# Altium project Honolulu.PrjPcb (part 3 of 3)

## Sheet I2C extender 1.SchDoc
size A4; SheetNumber: 5; SheetTotal: 6
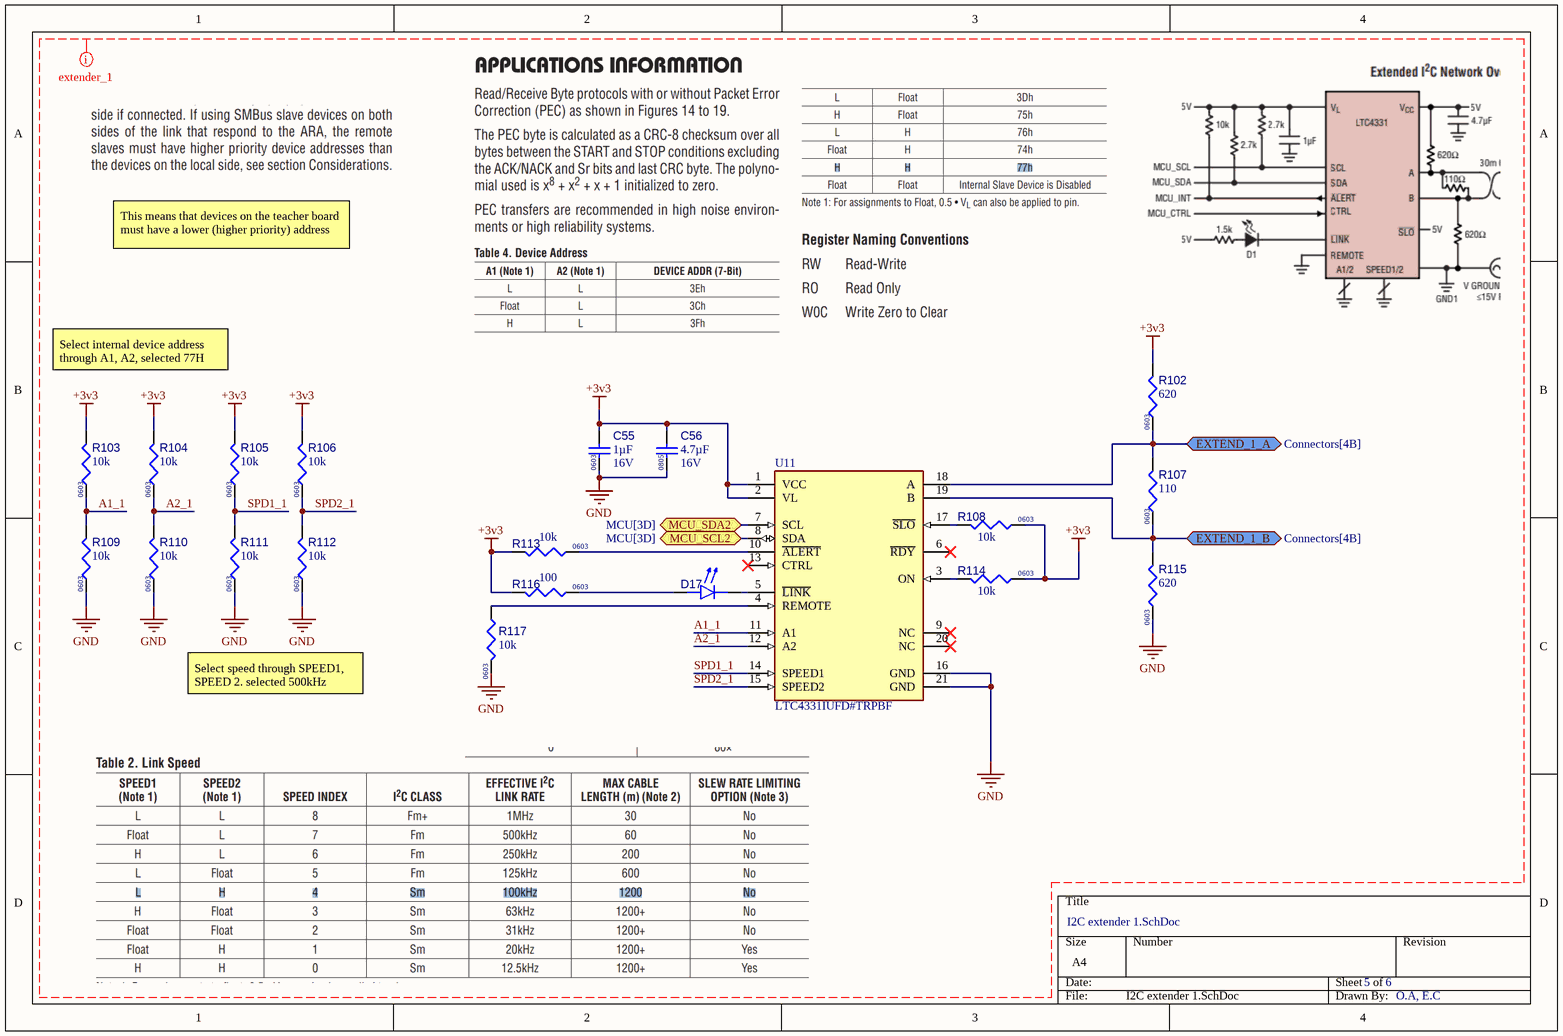
[diagram p8: I2C extender 1.SchDoc]

### Parts
C55  value 1µF  Case/Package: 0603  Voltage Rating: 16V  [CAPC1608X90X35NL15T15]  (hidden comment: Capacitor 1uF +/- 10% 16V 0603)
C56  value 4.7µF  Case/Package: 0805  Rated DC Voltage (URdc): 16V  [CL21A475KOFNNNE-Footprint-1]  (hidden comment: CL21A475KOFNNNE)
D17  150060YS75000  [WL-SMCW_0603_150060xx75000]  (value not drawn)
R102  value 620  Case/Package: 0603  [RC0603JR-0720KL-Footprint-1]  (hidden comment: RC0603FR-07620RL)
R103  value 10k  Case/Package: 0603  [RESC1608X55X25NL10T15]  (hidden comment: Resistor 10k +/-1% 0603 100 mW)
R104  value 10k  Case/Package: 0603  [RESC1608X55X25NL10T15]  (hidden comment: Resistor 10k +/-1% 0603 100 mW)
R105  value 10k  Case/Package: 0603  [RESC1608X55X25NL10T15]  (hidden comment: Resistor 10k +/-1% 0603 100 mW)
R106  value 10k  Case/Package: 0603  [RESC1608X55X25NL10T15]  (hidden comment: Resistor 10k +/-1% 0603 100 mW)
R107  value 110  Case/Package: 0603  [RC0603JR-0720KL-Footprint-1]  (hidden comment: RC0603FR-07110RL)
R108  value 10k  Case/Package: 0603  [RESC1608X55X25NL10T15]  (hidden comment: Resistor 10k +/-1% 0603 100 mW)
R109  value 10k  Case/Package: 0603  [RESC1608X55X25NL10T15]  (hidden comment: Resistor 10k +/-1% 0603 100 mW)
R110  value 10k  Case/Package: 0603  [RESC1608X55X25NL10T15]  (hidden comment: Resistor 10k +/-1% 0603 100 mW)
R111  value 10k  Case/Package: 0603  [RESC1608X55X25NL10T15]  (hidden comment: Resistor 10k +/-1% 0603 100 mW)
R112  value 10k  Case/Package: 0603  [RESC1608X55X25NL10T15]  (hidden comment: Resistor 10k +/-1% 0603 100 mW)
R113  value 10k  Case/Package: 0603  [RESC1608X55X25NL10T15]  (hidden comment: Resistor 10k +/-1% 0603 100 mW)
R114  value 10k  Case/Package: 0603  [RESC1608X55X25NL10T15]  (hidden comment: Resistor 10k +/-1% 0603 100 mW)
R115  value 620  Case/Package: 0603  [RC0603JR-0720KL-Footprint-1]  (hidden comment: RC0603FR-07620RL)
R116  value 100  Case/Package: 0603  [RC0603JR-0720KL-Footprint-1]  (hidden comment: RC0603FR-07100RL)
R117  value 10k  Case/Package: 0603  [RESC1608X55X25NL10T15]  (hidden comment: Resistor 10k +/-1% 0603 100 mW)
U11  LTC4331IUFD#TRPBF  [FP-UFD-20-05-08-1711-IPC_C]

### Ports
EXTEND_1_A (bidir, see Connectors[4B]), EXTEND_1_B (bidir, see Connectors[4B]), MCU_SCL2 (bidir, see MCU[3D]), MCU_SDA2 (bidir, see MCU[3D])

### Nets
+3V3: C55.2 C56.2 R102.2 R103.2 R104.2 R105.2 R106.2 R108.1 R113.1 R114.1 R116.2 U11.1(VCC) U11.2(VL)
GND: C55.1 C56.1 R109.1 R110.1 R111.1 R112.1 R115.1 R117.1 U11.16(GND) U11.21(GND)
A1_1: R103.1 R109.2 U11.11(A1)
A2_1: R104.1 R110.2 U11.12(A2)
SCL2: U11.8(SDA) ; port MCU_SCL2
SDA2: U11.7(SCL) ; port MCU_SDA2
SPD1_1: R105.1 R111.2 U11.14(SPEED1)
SPD2_1: R106.1 R112.2 U11.15(SPEED2)
NetD17_1: D17.1(K) U11.5(~{LINK})
NetD17_2: D17.2(A) R116.1
NetJ20_5: R102.1 R107.2 U11.18(A) ; port EXTEND_1_A
NetJ20_6: R107.1 R115.2 U11.19(B) ; port EXTEND_1_B
NetR108_2: R108.2 U11.17(~{SLO})
NetR113_2: R113.2 U11.10(~{ALERT})
NetR114_2: R114.2 U11.3(ON)
NetR117_2: R117.2 U11.4(REMOTE)

Not connected (* = marked no-connect by the designer): U11 6(~{RDY})* 9(NC)* 13(CTRL)* 20(NC)*

### Layout directives
mark named extender_1: +3v3, A1_1, A2_1, GND, SPD1_1, SPD2_1

### Notes on the sheet
- This means that devices on the teacher board must have a lower (higher priority) address
- Select internal device address through A1, A2, selected 77H
- Select speed through SPEED1, SPEED 2. selected 500kHz
- O.A, E.C

### Library data of the parts
C55 = CMP-001-00004-8: Chip Capacitor, 1 uF, +/- 10%, 16 V, 0603 (1608 Metric); Capacitor Type: Ceramic; Mounting Technology: SM; RoHS Compliant: True; Min Operating Temperature: -55°C; Pins: 2; Max Operating Temperature: 125°C; Tolerance: 10%
C56 = CMP-001-00089-2: Ceramic Capacitor, Multilayer, Ceramic, 16V, 10% +Tol, 10% -Tol, X5R, 15% TC, 4.7uF, Surface Mount, 0805; Multilayer: Yes; Dielectric Material: Ceramic; Tolerance (fill in as +-): 10%; Pins: 2; Package Style: SMTMeter; Max Operating Temperature: 85°C; JESD-609 Code: e3; Termination: Wraparound; Min Operating Temperature: -55°C; RoHS Compliant: Yes; Mounting Technology: Surface Mount; Reach SVHC Compliant: Yes; Terminal Finish: Nickel; Packaging: Tape and Reel; Capacitor Type: Ceramic; Height: 1.35mm; Width: 1.25mm; Temperature Characteristics Code: X5R; Length: 2mm; Tolerance  (fill in as +-): 10%; Package Shape: Rectangular
D17 = CMP-007-00046-1: Single Color LED, Yellow, Water Clear, 1.1mm; Shape: Rectangular; Forward Current: 30mA; Forward Voltage: 2V; Viewing Angle: 140°; Channels: 1; Luminous Intensity-Nom: 120mcd; Overall Height: 0.7mm; Packaging: Tape and Reel; Size: 1.1mm; Max Operating Temperature: 85°C; RoHS Compliant: Yes; Color: Yellow; Pins: 2; Lens Style: WATER CLEAR; Reach SVHC Compliant: Yes; Terminal Pitch: 1.6mm; Mounting Technology: Surface Mount; Min Operating Temperature: -40°C; Optoelectronic Device Type: SINGLE COLOR LED
R102 R115 = CMP-009-00191-1: Fixed Resistor, Metal Glaze/thick Film, 0.1W, 620ohm, 75V, 1% +/-Tol, 100ppm/Cel, Surface Mount, 0603; Power: 100mW; Additional Feature: LASER TRIMMABLE; Package Height: 0.45mm; Package Width: 0.8mm; Temperature Coefficient: 100ppm/°C; Rated Temperature: 70°C; Package Length: 1.6mm; Package Shape: Rectangular; Min Operating Temperature: -55°C; Technology: METAL GLAZE/THICK FILM; Reach SVHC Compliant: Yes; Pins: 2; Working Voltage: 75V; Tolerance: 1%; Terminal Finish: Nickel; RoHS Compliant: Yes; Termination: Wraparound; Construction: Chip; JESD-609 Code: e3; Mounting Technology: Surface Mount; Max Operating Temperature: 155°C; Package Style: SMTMeter; Packaging: Tape and Reel; Resistor Type: FIXED RESISTOR
R103-R106 R108-R114 R117 = CMP-009-00017-7: as R88-R94 on sheet I2C extender 0; RoHS Compliant: True; Min Operating Temperature: -55°C; Pins: 2; Mounting Technology: SM; Max Operating Temperature: 155°C; Tolerance: 1%
R107 = CMP-009-00190-1: Fixed Resistor, Metal Glaze/thick Film, 0.1W, 110ohm, 75V, 1% +/-Tol, 100ppm/Cel, Surface Mount, 0603; Package Length: 1.6mm; Temperature Coefficient: 100ppm/°C; Power: 100mW; Package Height: 0.45mm; Package Width: 0.8mm; Additional Feature: LASER TRIMMABLE; Rated Temperature: 70°C; Termination: Wraparound; JESD-609 Code: e3; RoHS Compliant: Yes; Tolerance: 1%; Max Operating Temperature: 155°C; Package Style: SMTMeter; Terminal Finish: Nickel; Packaging: Tape and Reel; Package Shape: Rectangular; Pins: 2; Working Voltage: 75V; Construction: Chip; Resistor Type: FIXED RESISTOR; Technology: METAL GLAZE/THICK FILM; Reach SVHC Compliant: Yes; Mounting Technology: Surface Mount; Min Operating Temperature: -55°C
R116 = CMP-009-00189-1: Fixed Resistor, Metal Glaze/thick Film, 0.1W, 100ohm, 75V, 1% +/-Tol, 100ppm/Cel, Surface Mount, 0603; Rated Temperature: 70°C; Package Width: 0.8mm; Package Length: 1.6mm; Package Height: 0.45mm; Additional Feature: LASER TRIMMABLE; Temperature Coefficient: 100ppm/°C; Power: 100mW; Package Shape: Rectangular; Tolerance: 1%; JESD-609 Code: e3; Resistor Type: FIXED RESISTOR; Terminal Finish: Nickel; Max Operating Temperature: 155°C; Reach SVHC Compliant: Yes; Technology: METAL GLAZE/THICK FILM; Mounting Technology: Surface Mount; RoHS Compliant: Yes; Construction: Chip; Packaging: Tape and Reel; Package Style: SMTMeter; Termination: Wraparound; Working Voltage: 75V; Min Operating Temperature: -55°C; Pins: 2
U11 = CMP-015-00011-1: Interface Circuit, CMOS, PQCC20; Throw Configuration: POWER SUPPLY SUPPORT CIRCUIT; Reach SVHC Compliant: Yes; RoHS Compliant: Yes

## Sheet Connectors.SchDoc
size A4; SheetNumber: 7; SheetTotal: 6
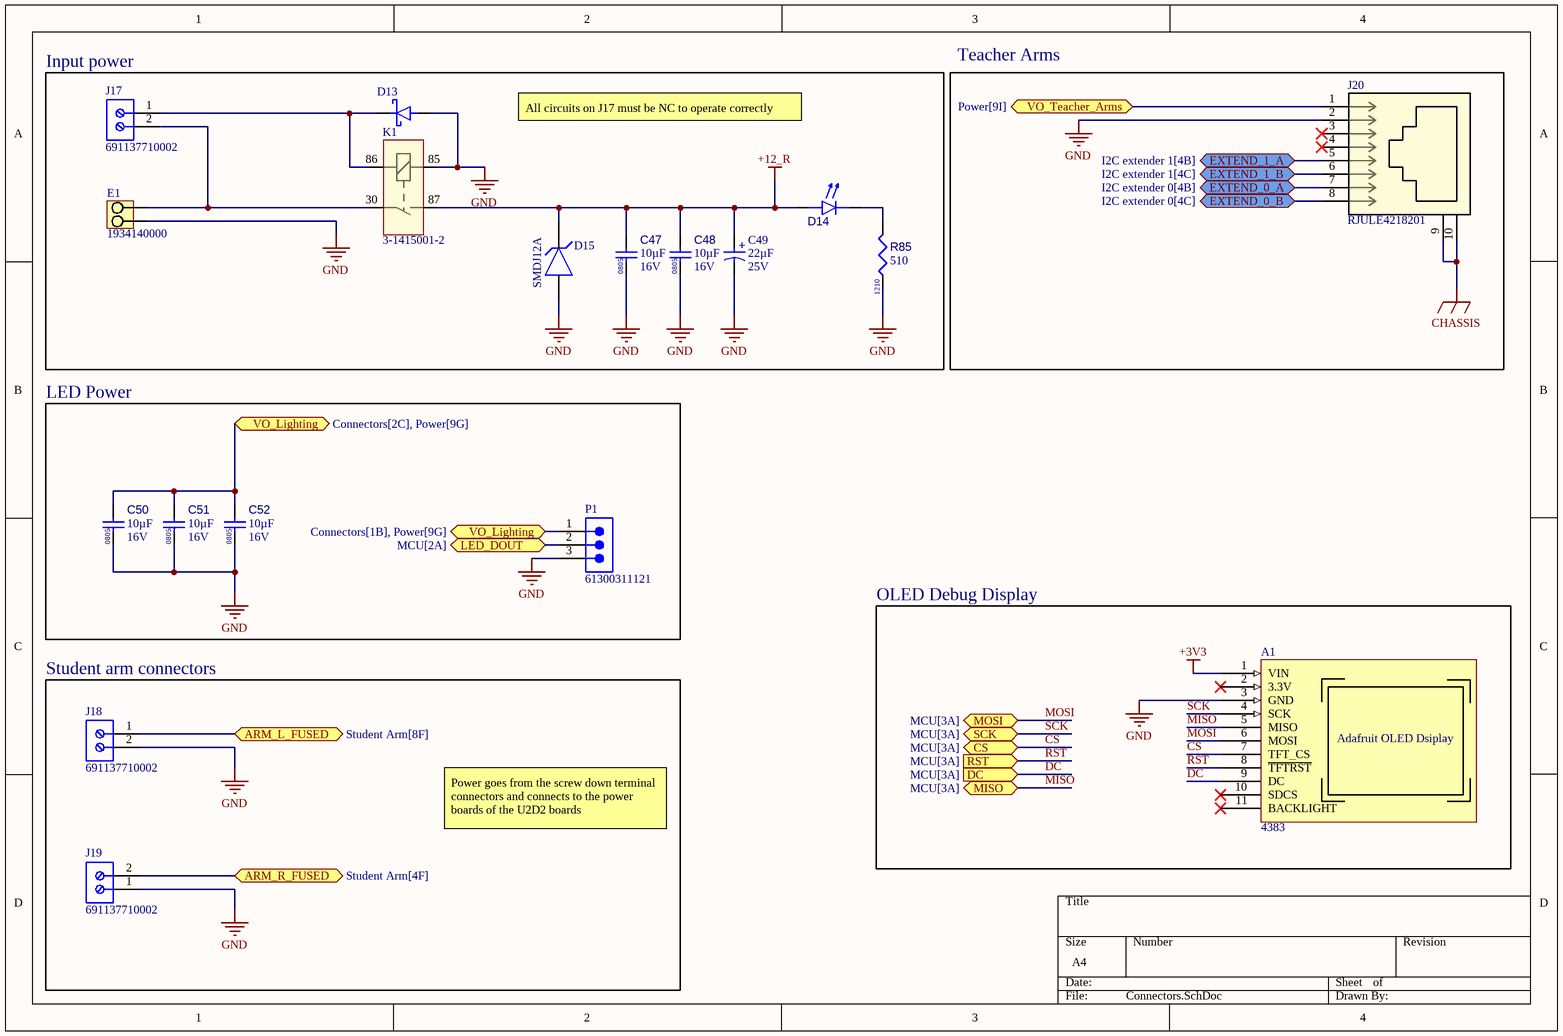
[diagram p9: Connectors.SchDoc]

### Parts
A1  4383  [4383-Footprint-1]
C47  value 10µF  Voltage Rating: 16V  Case/Package: 0805  [CAP CER 10UF 16V X5R 0805-Footprint-1]  (hidden comment: CAP CER 10UF 16V X5R 0805)
C48  value 10µF  Voltage Rating: 16V  Case/Package: 0805  [CAP CER 10UF 16V X5R 0805-Footprint-1]  (hidden comment: CAP CER 10UF 16V X5R 0805)
C49  value 22µF  Voltage Rating: 25V  [WCAP-PSLP_D6.3H5.8]  (hidden comment: 875105544003)
C50  value 10µF  Voltage Rating: 16V  Case/Package: 0805  [CAP CER 10UF 16V X5R 0805-Footprint-1]  (hidden comment: CAP CER 10UF 16V X5R 0805)
C51  value 10µF  Voltage Rating: 16V  Case/Package: 0805  [CAP CER 10UF 16V X5R 0805-Footprint-1]  (hidden comment: CAP CER 10UF 16V X5R 0805)
C52  value 10µF  Voltage Rating: 16V  Case/Package: 0805  [CAP CER 10UF 16V X5R 0805-Footprint-1]  (hidden comment: CAP CER 10UF 16V X5R 0805)
D13  VS-10BQ015-M3/5BT  [FP-95401-MFG]  (value not drawn)
D14  150060RS75000  [WL-SMCW_0603_150060xx75000]  (value not drawn)
D15  SMDJ12A  [FP-DO-214AB_SMC_J-Bend-MFG]
E1  1934140000  [LU_10_16_90_02]
J17  691137710002  [691137710002]
J18  691137710002  [691137710002]
J19  691137710002  [691137710002]
J20  RJULE4218201  [RJULE4218201-Footprint-1]
K1  3-1415001-2  [3-1415001-2-Footprint-1]
P1  61300311121  [61300311121]
R85  value 510  Case/Package: 1210  [RESC3126X60X50NL10T20]  (hidden comment: RC1210JR-07510RL)

### Blocks framed on the sheet
Input power: C47-C49 D13-D15 E1 J17 K1 R85
Teacher Arms: J20
LED Power: C50-C52 P1
OLED Debug Display: A1
Student arm connectors: J18 J19

### Ports
ARM_L_FUSED (bidir, see Student Arm[8F]), ARM_R_FUSED (bidir, see Student Arm[4F]), CS (bidir, see MCU[3A]), DC (in, see MCU[3A]), EXTEND_0_A (bidir, see I2C extender 0[4B]), EXTEND_0_B (bidir, see I2C extender 0[4C]), EXTEND_1_A (bidir, see I2C extender 1[4B]), EXTEND_1_B (bidir, see I2C extender 1[4C]), LED_DOUT (bidir, see MCU[2A]), MISO (bidir, see MCU[3A]), MOSI (bidir, see MCU[3A]), RST (in, see MCU[3A]), SCK (bidir, see MCU[3A]), VO_Lighting (bidir, see Connectors[1B], Power[9G]), VO_Lighting (bidir, see Connectors[2C], Power[9G]), VO_Teacher_Arms (bidir, see Power[9I])

### Nets
+3V3: A1.1(VIN)
+12_R: C47.2 C48.2 C49.1(P) D14.2(A) D15.1(C) K1.87  [project net ARM_L_int]
CHASSIS: J20.9 J20.10
GND: A1.3(GND) C47.1 C48.1 C49.2(N) C50.1 C51.1 C52.1 D13.2(A) D15.2(A) E1.A2 J18.2 J19.1 J20.2 K1.85 P1.3 R85.1
ARM_L: J18.1 ; port ARM_L_FUSED
ARM_R: J19.2 ; port ARM_R_FUSED
CS: A1.7(TFT_CS) ; port CS
DC: A1.9(DC) ; port DC
MISO: A1.5(MISO) ; port MISO
MOSI: A1.6(MOSI) ; port MOSI
RST: A1.8(~{TFTRST}) ; port RST
SCK: A1.4(SCK) ; port SCK
NetC50_2: C50.2 C51.2 C52.2 P1.1 ; port VO_Lighting
NetD13_1: D13.1(C) J17.1 K1.86
NetD14_1: D14.1(K) R85.2
NetE1_A1: E1.A1 J17.2 K1.30
NetJ20_1: J20.1 ; port VO_Teacher_Arms
NetJ20_5: J20.5 ; port EXTEND_1_A
NetJ20_6: J20.6 ; port EXTEND_1_B
NetJ20_7: J20.7 ; port EXTEND_0_A
NetJ20_8: J20.8 ; port EXTEND_0_B
NetMD1_5: P1.2 ; port LED_DOUT

Not connected (* = marked no-connect by the designer): A1 2(3.3V)* 10(SDCS)* 11(BACKLIGHT)*; J20 3* 4*

### Notes on the sheet
- All circuits on J17 must be NC to operate correctly
- Power goes from the screw down terminal connectors and connects to the power boards of the U2D2 boards
- (in symbol CMP-001-00085-2) +
- (in symbol CMP-004-000002-4) Adafruit OLED Dsiplay

### Library data of the parts
A1 = CMP-004-000002-4: Adafruit OLED display
C47 C48 C50-C52 = CMP-001-00084-6: Ceramic Capacitor, Multilayer, Ceramic, 16V, 10% +Tol, 10% -Tol, X5R, 15% TC, 10uF, Surface Mount, 0805; Pins: 2; Capacitor Type: Ceramic; Max Operating Temperature: 85°C; Min Operating Temperature: -55°C; RoHS Compliant: Yes; Mounting Technology: Surface Mount
C49 = CMP-001-00085-2: 22 µF 25 V Aluminum - Polymer Capacitors Radial, Can - SMD 30mOhm 2000 Hrs @ 105°C; Tolerance: 20%; Capacitor Type: Aluminium; Pins: 2; RoHS Compliant: Yes
D13 = CMP-004-00041-2: Rectifier Diode, Schottky, 1 Phase, 1 Element, 1A, 15V V(RRM), Silicon; Number of Elements: 1; Package Body Material: Plastic; Non-rep Pk Forward Current-Max: 40A; Forward Voltage: 210mV; Pins: 2; Rep Pk Reverse Voltage-Max: 15V; Min Operating Temperature: -55°C; Surface Mount: Yes; Package Style: SMALL OUTLINEMeter; Max Operating Temperature: 125°C; Max Output current: 1A; JESD-609 Code: e3; Terminal Form: C BEND; JESD-30 Code: R-PDSO-C2; RoHS Compliant: Yes; Reach SVHC Compliant: No; Package Shape: Rectangular; Diode Element Material: SILICON; Terminal Finish: Tin; Moisture Sensitivity Level: 1; Terminal Position: DUAL; Diode Type: RECTIFIER; Technology: SCHOTTKY
D14 = CMP-007-00036-1: Single Color LED, Red, Water Clear, 1.1mm; Forward Current: 30mA; Max Operating Temperature: 85°C; Mounting Technology: Surface Mount; RoHS Compliant: Yes; Pins: 2; Min Operating Temperature: -40°C
D15 = CMP-004-00033-1: Trans Voltage Suppressor Diode, 3000W, 12V V(RWM), Unidirectional, 1 Element, Silicon, DO-214AB; Max Operating Temperature: 150°C; RoHS Compliant: Yes; Min Operating Temperature: -65°C; Pins: 2
E1 = CMP-1560-00480-1: OMNIMATE Power - series LU; Manufacturer: Weidmueller; Solid_max_H05_07_V_U: 16 mm²; Wire_cross_section_AWG_max_UL_1059: AWG 6; Short_text_for_material: LU 10.16/02/90 4.5SN BK BX; Insulating_material: Wemid (PA); Solder_pin_length_mm: 4,5 mm; Side_termination_characteristic: closed side; Wire_cross_section_AWG_min_UL_1059: AWG 26; UL_94_flammability_rating: V-0; Rated_voltage_use_group_B_UL_1059: 300 V; Contact_material: E-Cu; No_of_poles: 2; Rated_voltage_for_surge_voltage_class_pollution_degree_II_2: 1000 V; Pitch_inch: 0,4 inch; Pitch_mm: 10,16 mm; Rated_current_use_group_B_UL_1059: 65 A; Solid_min_H05_07_V_U: 0,5 mm²; Mounting_onto_the_PCB: Solder connection; Contact_surface: tinned; Revision: V1; ComponentLink2Description: URL Link1; Packaging: Box; ComponentLink2URL: http://catalog.weidmueller.com/catalog/Start.do?localeId=en&ObjectID=1934140000; Colour: Black; PackageReference: LU_10_16_90_02; Qty: 20 PCS; ComponentLink1Description: Manufacturer URL; PartNumber: 1934140000; ComponentLink1URL: http://www.weidmueller.com/
J17-J19 = CMP-002-00078-1: Series 1377 - 5.00 mm Horizontal Entry with Pressure Clamp WR-TBL, 2 pin; RoHS Compliant: Yes
J20 = CMP-002-00075-4: Modular Jack - Right Angle, Input Output Connectors RJ45, 8P8C, Without LEDs, Shield.
K1 = CMP-008-00005-1: Power/Signal Relay, SPST, Momentary, 0.13A (Coil), 12VDC (Coil), 1600mW (Coil), 30A (Contact), 24VDC (Contact), DC Input, DC Output, Panel Mount; Reference Standard: UL; Coil Voltage(DC)-Max: 12V; Contact Voltage(DC)-Max: 24V; Coil Current(DC)-Max: 130mA; Body Length or Diameter: 25.9mm; Body Breadth: 25.9inch; Body Height: 24.9mm; Release Time: 2ms; Coil Power: 1.6W; Electrical Life: 100000Cycles; Coil Release Voltage(DC): 1.6V; Coil Operate Voltage(DC): 7.2V; Operate Time: 7ms; Contact DC Max Rating R Load: 30A@24VDC; Sealing: IP54; IP67; RT1; RT3; Coil Resistance: 90R; Min Operating Temperature: -40°C; Mounting Technology: Panel; Termination: Quick Connect; Relay Type: POWER/SIGNAL RELAY; Contact Current(DC)-Max: 30A; Packaging: Box; Reach SVHC Compliant: Yes; RoHS Compliant: Yes; Relay Action: MOMENTARY; Max Operating Temperature: 125°C; Coil/Input Supply Type: DC; Relay Function: SPST; Contact/Output Supply Type: DC
P1 = CMP-002-00076-1: Board Connector, 3 Contact(s), 1 Row(s), Male, Straight, 0.1 inch Pitch, Solder Terminal, Locking, Black Insulator, Plug; Min Operating Temperature: -40°C; Connector Type: BOARD CONNECTOR; RoHS Compliant: Yes; Mounting Technology: Board; Max Operating Temperature: 125°C
R85 = CMP-009-00179-1: Fixed Resistor, Metal Glaze/thick Film, 0.5W, 510ohm, 200V, 5% +/-Tol, 100ppm/Cel, Surface Mount, 1210; Power: 500mW; Pins: 2; Min Operating Temperature: -55°C; Mounting Technology: Surface Mount; Max Operating Temperature: 155°C; RoHS Compliant: Yes; Tolerance: 5%

## Nets that join several sheets
+3V3: MCU (12 pins), Power (30 pins), I2C extender 0 (13 pins), I2C extender 1 (13 pins), Connectors (A1.1)
+5V: Student Arm (12 pins), MCU (MD1.VIN R30.2 R31.2 R33.2), Power (13 pins)
ARM_L_int: Student Arm (20 pins), Power (10 pins), Connectors (6 pins)
CHASSIS: Main (18 pins), Connectors (J20.9 J20.10)
GND: Main (12 pins), Student Arm (34 pins), MCU (7 pins), Power (70 pins), I2C extender 0 (10 pins), I2C extender 1 (10 pins), Connectors (16 pins)
ARM_L: Student Arm (8 pins), Connectors (J18.1)
ARM_R: Student Arm (8 pins), Connectors (J19.2)
CS: MCU (MD1.10), Connectors (A1.7)
DC: MCU (MD1.6), Connectors (A1.9)
EN_5V: MCU (Q7.3 R30.1), Power (Q13.1 S7.2 TP23.1 U5.4)
EN_ARM_L: Student Arm (Q6.1 S4.2 TP6.1 U1.4), MCU (Q9.3 R33.1)
EN_ARM_R: Student Arm (Q5.1 S3.2 TP5.1 U2.4), MCU (Q8.3 R31.1)
GOK_5V: MCU (MD1.34), Power (Q11.1 R68.1 TP25.1 U5.5)
GOK_ARM_L: Student Arm (Q3.1 R21.1 TP10.1 U1.5), MCU (MD1.3)
GOK_ARM_R: Student Arm (Q1.1 R19.1 TP9.1 U2.5), MCU (MD1.33)
Imon_5V: MCU (MD1.40), Power (C30.2 R56.2 TP21.1 U5.22)
Imon_L: Student Arm (C1.2 R11.2 TP2.1 U1.22), MCU (MD1.27)
Imon_R: Student Arm (C2.2 R12.2 TP1.1 U2.22), MCU (MD1.26)
MISO: MCU (MD1.12), Connectors (A1.5)
MOSI: MCU (MD1.11), Connectors (A1.6)
NetC50_2: Power (R62.1 R65.1 TP27.1), Connectors (C50.2 C51.2 C52.2 P1.1)
NetJ20_1: Power (R48.1 R54.1 TP26.1), Connectors (J20.1)
NetJ20_5: I2C extender 1 (R102.1 R107.2 U11.18), Connectors (J20.5)
NetJ20_6: I2C extender 1 (R107.1 R115.2 U11.19), Connectors (J20.6)
NetJ20_7: I2C extender 0 (R86.1 R87.2 U10.18), Connectors (J20.7)
NetJ20_8: I2C extender 0 (R87.1 R95.2 U10.19), Connectors (J20.8)
NetMD1_5: MCU (MD1.5 TP11.1), Connectors (P1.2)
OC_5V: MCU (MD1.35), Power (Q12.1 R69.1 TP24.1 U5.3)
OC_ARM_L: Student Arm (Q4.1 R22.1 TP8.1 U1.3), MCU (MD1.4)
OC_ARM_R: Student Arm (Q2.1 R20.1 TP7.1 U2.3), MCU (MD1.29)
RST: MCU (MD1.2), Connectors (A1.8)
SCK: MCU (MD1.13), Connectors (A1.4)
SCL0: MCU (MD1.19 R40.1 TP20.1), Power (8 pins)
SCL1: MCU (MD1.16 R38.1 TP18.1), I2C extender 0 (U10.8)
SCL2: MCU (MD1.24 R36.1 TP16.1), I2C extender 1 (U11.8)
SDA0: MCU (MD1.18 R39.1 TP19.1), Power (8 pins)
SDA1: MCU (MD1.17 R37.1 TP17.1), I2C extender 0 (U10.7)
SDA2: MCU (MD1.25 R35.1 TP15.1), I2C extender 1 (U11.7)
Vtemp_5V: MCU (MD1.41), Power (C33.2 TP22.1 U5.18)
Vtemp_L: Student Arm (C7.2 TP4.1 U1.18), MCU (MD1.38)
Vtemp_R: Student Arm (C8.2 TP3.1 U2.18), MCU (MD1.39)

## Assembly variants
V1_Production: not fitted C64 C65 C66 C67 C68 C69 C? C? C? C? C? C? C? J? J? J? J? J? J? J? J? R6 R7 R51 R52 R73 R118 R119 R120 R? R? R? R? R? R? R? R? R? R? R? R? R? R? R? R? R? R?